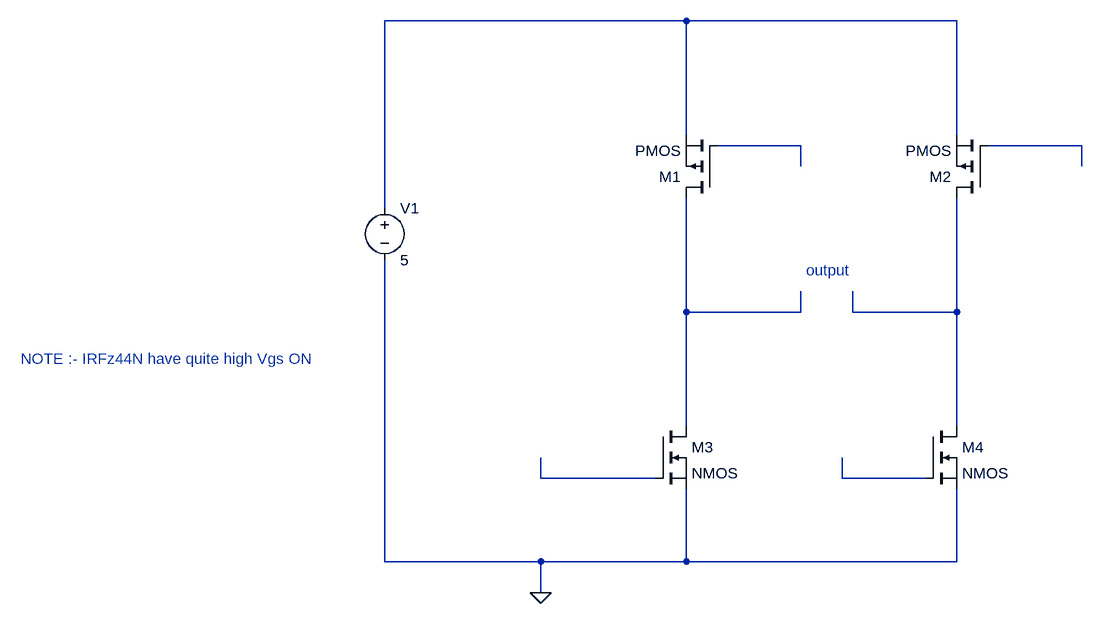
[diagram p0: schematic H Bridge Driver using MOSFET.asc]
H Bridge Driver using MOSFET.asc, the LTspice schematic file:
Version 4
SHEET 1 884 680
WIRE 272 -432 -192 -432
WIRE 688 -432 272 -432
WIRE 272 -256 272 -432
WIRE 688 -256 688 -432
WIRE 448 -240 320 -240
WIRE 880 -240 736 -240
WIRE 448 -208 448 -240
WIRE 880 -208 880 -240
WIRE -192 -144 -192 -432
WIRE 272 16 272 -160
WIRE 448 16 448 -16
WIRE 448 16 272 16
WIRE 528 16 528 -16
WIRE 688 16 688 -160
WIRE 688 16 528 16
WIRE 272 192 272 16
WIRE 688 192 688 16
WIRE 48 272 48 240
WIRE 224 272 48 272
WIRE 512 272 512 240
WIRE 640 272 512 272
WIRE -192 400 -192 -64
WIRE 48 400 -192 400
WIRE 272 400 272 288
WIRE 272 400 48 400
WIRE 688 400 688 288
WIRE 688 400 272 400
WIRE 48 448 48 400
FLAG 48 448 0
SYMBOL nmos 224 192 R0
SYMATTR InstName M3
SYMBOL nmos 640 192 R0
SYMATTR InstName M4
SYMBOL pmos 320 -160 R180
SYMATTR InstName M1
SYMBOL pmos 736 -160 R180
SYMATTR InstName M2
SYMBOL voltage -192 -160 R0
SYMATTR InstName V1
SYMATTR Value 5
TEXT 456 -48 Left 2 ;output
TEXT -752 88 Left 2 ;NOTE :- IRFz44N have quite high Vgs ON

The netlist it stands for:
* H Bridge Driver using MOSFET.asc
M3 N004 N006 0 0 NMOS
M4 N005 N007 0 0 NMOS
M1 N004 N002 N001 N001 PMOS
M2 N005 N003 N001 N001 PMOS
V1 N001 0 5
.model NMOS NMOS
.model PMOS PMOS
.lib standard.mos
* output
* NOTE :- IRFz44N have quite high Vgs ON
.backanno
.end